# EAGLE design TA#2_DONG (EAGLE 6.2)
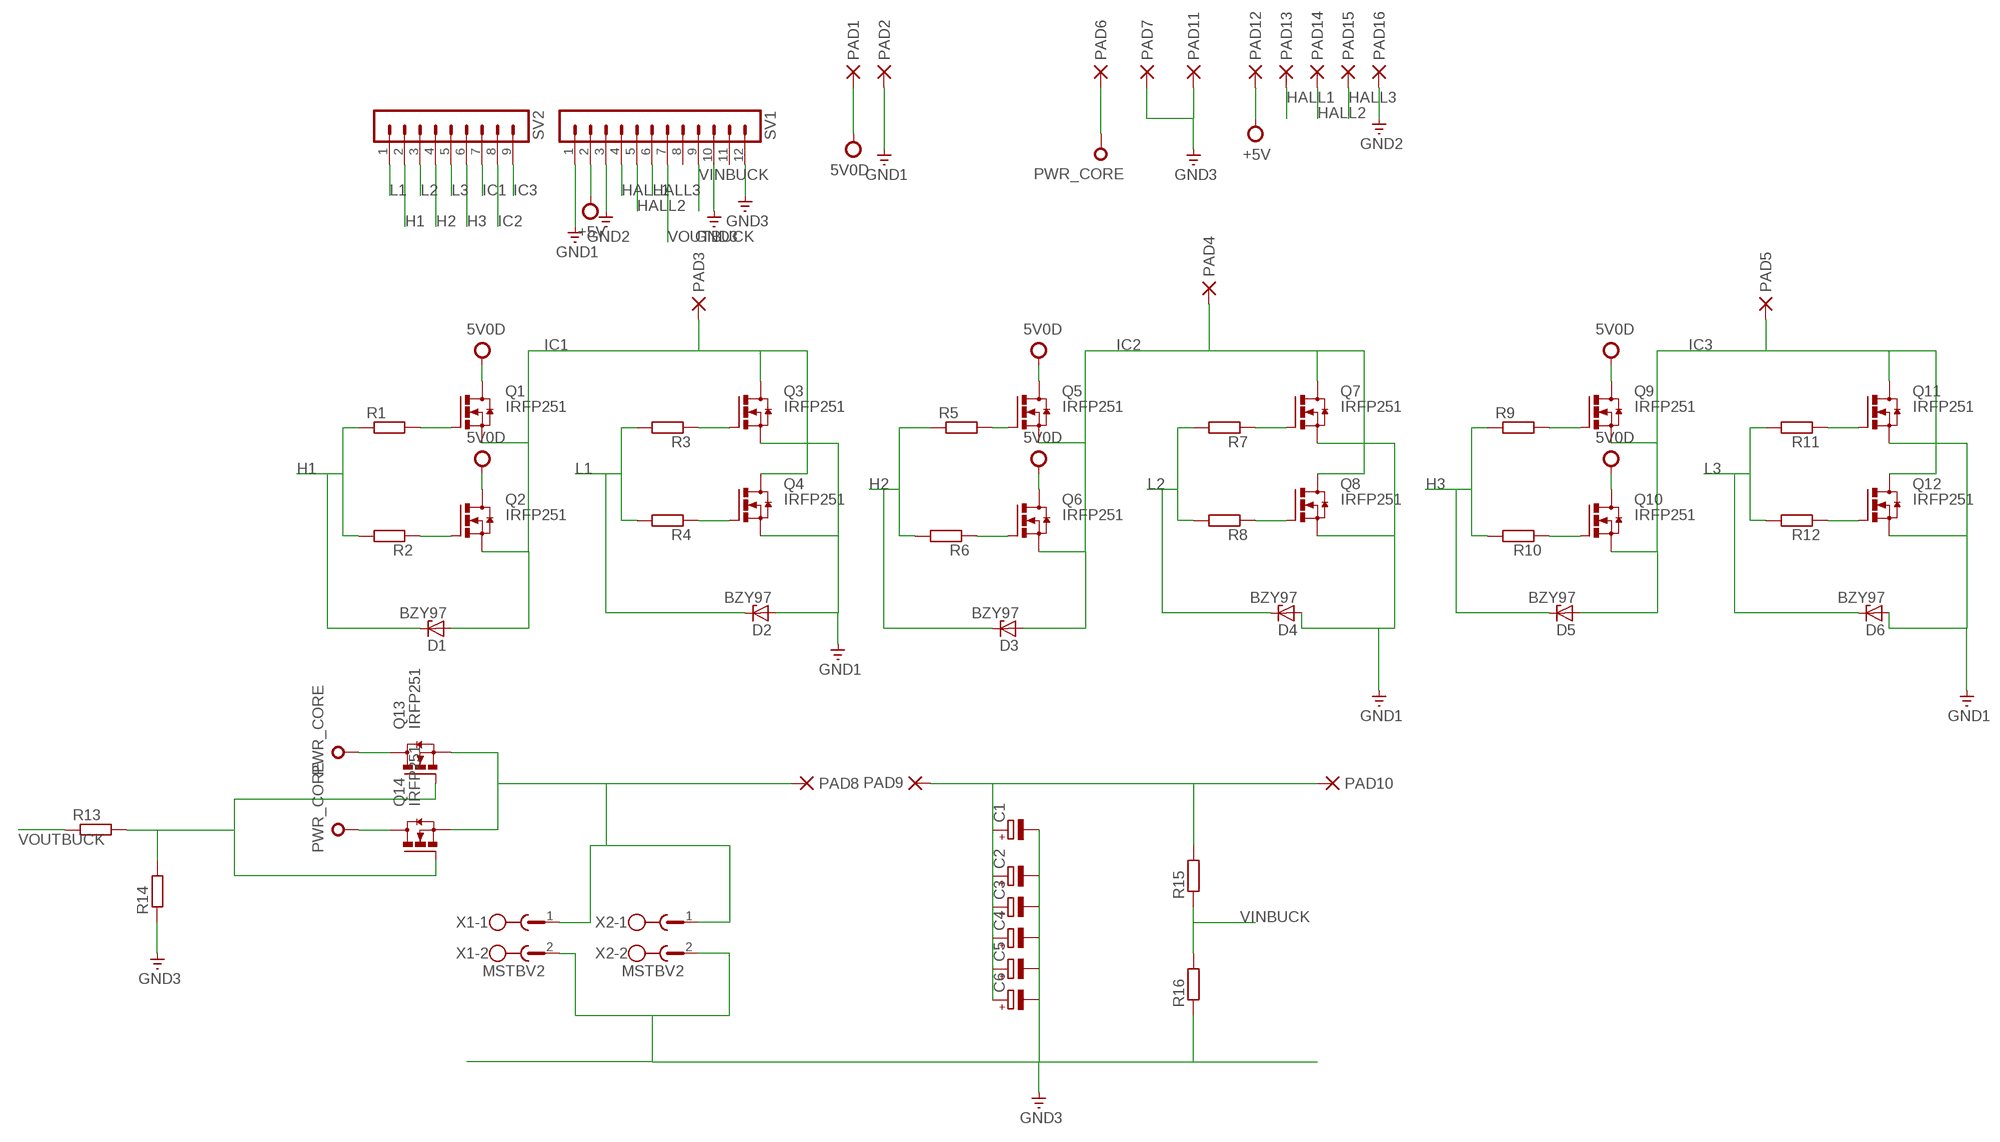
[diagram p0: schematic, sheet 1]

## Parts
C1  CPOL-EUTT5D9  [TT5D9]
C2  CPOL-EUTT5D9  [TT5D9]
C3  CPOL-EUTT5D9  [TT5D9]
C4  CPOL-EUTT5D9  [TT5D9]
C5  CPOL-EUTT5D9  [TT5D9]
C6  CPOL-EUTT5D9  [TT5D9]
D1  BZY97  [F126Z12]
D2  BZY97  [F126Z12]
D3  BZY97  [F126Z12]
D4  BZY97  [F126Z12]
D5  BZY97  [F126Z12]
D6  BZY97  [F126Z12]
PAD1  PAD-0820  [0820]
PAD2  PAD-0820  [0820]
PAD3  PAD-0820  [0820]
PAD4  PAD-0820  [0820]
PAD5  PAD-0820  [0820]
PAD6  PAD-0820  [0820]
PAD7  PAD-0820  [0820]
PAD8  PAD-0820  [0820]
PAD9  PAD-0820  [0820]
PAD10  PAD-0820  [0820]
PAD11  PAD-0820  [0820]
PAD12  PAD-0820  [0820]
PAD13  PAD-0820  [0820]
PAD14  PAD-0820  [0820]
PAD15  PAD-0820  [0820]
PAD16  PAD-0820  [0820]
Q1  IRFP251  [TO-247AD-V]
Q2  IRFP251  [TO-247AD-V]
Q3  IRFP251  [TO-247AD-V]
Q4  IRFP251  [TO-247AD-V]
Q5  IRFP251  [TO-247AD-V]
Q6  IRFP251  [TO-247AD-V]
Q7  IRFP251  [TO-247AD-V]
Q8  IRFP251  [TO-247AD-V]
Q9  IRFP251  [TO-247AD-V]
Q10  IRFP251  [TO-247AD-V]
Q11  IRFP251  [TO-247AD-V]
Q12  IRFP251  [TO-247AD-V]
Q13  IRFP251  [TO-247AD-V]
Q14  IRFP251  [TO-247AD-V]
R1  R-EU_0207/15  [0207/15]
R2  R-EU_0207/15  [0207/15]
R3  R-EU_0207/15  [0207/15]
R4  R-EU_0207/15  [0207/15]
R5  R-EU_0207/15  [0207/15]
R6  R-EU_0207/15  [0207/15]
R7  R-EU_0207/15  [0207/15]
R8  R-EU_0207/15  [0207/15]
R9  R-EU_0207/15  [0207/15]
R10  R-EU_0207/15  [0207/15]
R11  R-EU_0207/15  [0207/15]
R12  R-EU_0207/15  [0207/15]
R13  R-EU_0207/15  [0207/15]
R14  R-EU_0207/15  [0207/15]
R15  R-EU_0207/15  [0207/15]
R16  R-EU_0207/15  [0207/15]
SV1  MA12-1  [MA12-1]
SV2  MA09-1  [MA09-1]
X1  MSTBV2  [MSTBV2]
X2  MSTBV2  [MSTBV2]

## Nets
5V0D: PAD1.P$1(P) Q1.D Q2.D Q5.D Q6.D Q9.D Q10.D
+5V: PAD12.P$1(P) SV1.2
GND1: D2.A D4.A D6.A PAD2.P$1(P) Q3.S Q4.S Q7.S Q8.S Q11.S Q12.S SV1.1
GND2: PAD16.P$1(P) SV1.3
GND3: C1.- C2.- C3.- C4.- C5.- C6.- PAD7.P$1(P) PAD11.P$1(P) R14.1 R16.1 SV1.10 SV1.12 X1.2 X2.2
H1: D1.C R1.1 R2.2 SV2.2
H2: D3.C R5.1 R6.2 SV2.4
H3: D5.C R9.1 R10.2 SV2.6
HALL1: PAD13.P$1(P) SV1.4
HALL2: PAD14.P$1(P) SV1.5
HALL3: PAD15.P$1(P) SV1.6
IC1: D1.A PAD3.P$1(P) Q1.S Q2.S Q3.D Q4.D SV2.7
IC2: D3.A PAD4.P$1(P) Q5.S Q6.S Q7.D Q8.D SV2.8
IC3: D5.A PAD5.P$1(P) Q9.S Q10.S Q11.D Q12.D SV2.9
L1: D2.C R3.2 R4.2 SV2.1
L2: D4.C R7.2 R8.2 SV2.3
L3: D6.C R11.2 R12.2 SV2.5
N$1: Q1.G R1.2
N$2: Q2.G R2.1
N$3: Q3.G R3.1
N$4: Q4.G R4.1
N$5: PAD8.P$1(P) Q13.S Q14.S X1.1 X2.1
N$6: Q13.G Q14.G R13.2 R14.2
N$7: Q5.G R5.2
N$9: C1.+ C2.+ C3.+ C4.+ C5.+ C6.+ PAD9.P$1(P) PAD10.P$1(P) R15.2
N$10: Q6.G R6.1
N$11: Q7.G R7.1
N$12: Q8.G R8.1
N$17: Q9.G R9.2
N$18: Q10.G R10.1
N$19: Q11.G R11.1
N$20: Q12.G R12.1
PWR_CORE: PAD6.P$1(P) Q13.D Q14.D
VINBUCK: R15.1 R16.2 SV1.9
VOUTBUCK: R13.1 SV1.7
Unconnected: SV1.8 SV1.11

## Library data of the parts
C1-C6 = rcl:CPOL-EU: POLARIZED CAPACITOR, European symbol
D1-D6 = diode-1:BZY97: Z DIODE
PAD1-PAD16 = dpads:PAD: WIRE PAD Standard US Drill Sizes and SMD pads
Q1-Q14 = transistor-power:IRFP25*: 33A/27A, 200V/150V, 0.085/0.012 Ohm, N-Channel Power MOSFET Source: Fairchild Semiconductor Corporation
R1-R16 = resistor:R-EU_: RESISTOR, European symbol
SV1 = con-lstb:MA12-1: PIN HEADER; OC_FARNELL: unknown; OC_NEWARK: unknown
SV2 = con-lstb:MA09-1: PIN HEADER; OC_FARNELL: unknown; OC_NEWARK: unknown
X1 X2 = con-phoenix-508:MSTBV2: PHOENIX; MPN: MSTBV 2,5/2-GF-5.08; OC_FARNELL: 1792792; OC_NEWARK: 69R9845

## Board
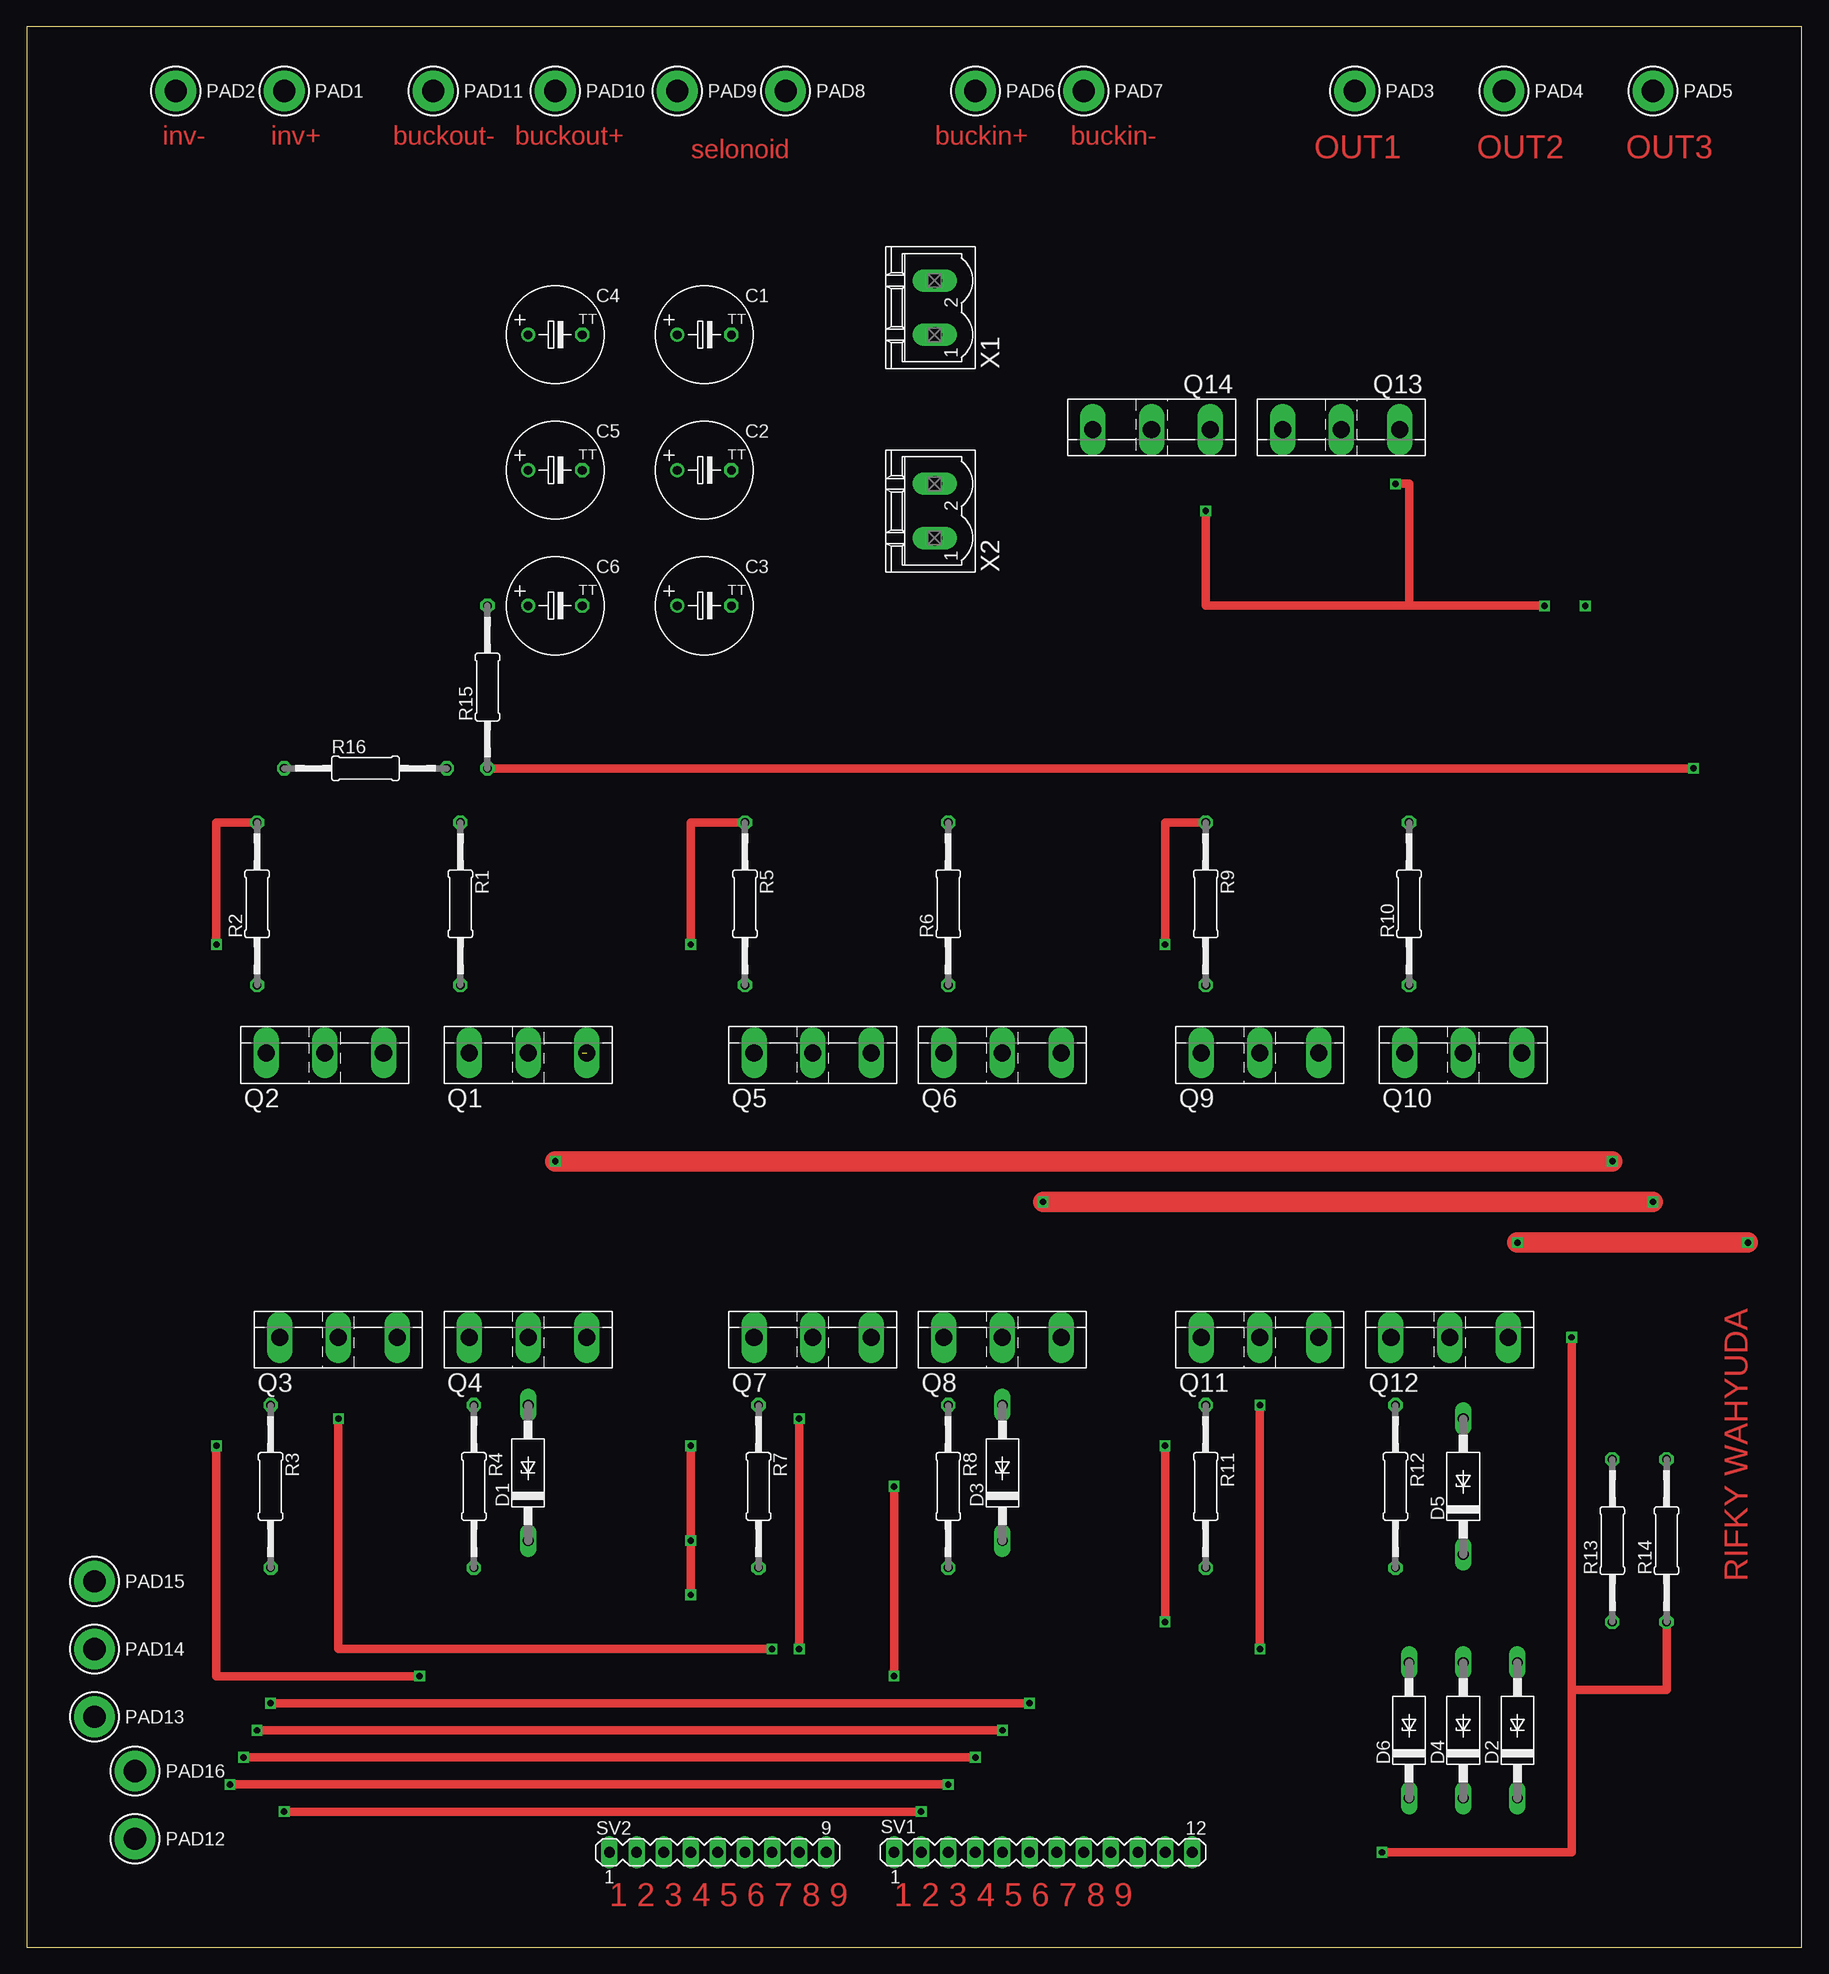
[diagram p1: board, top side]
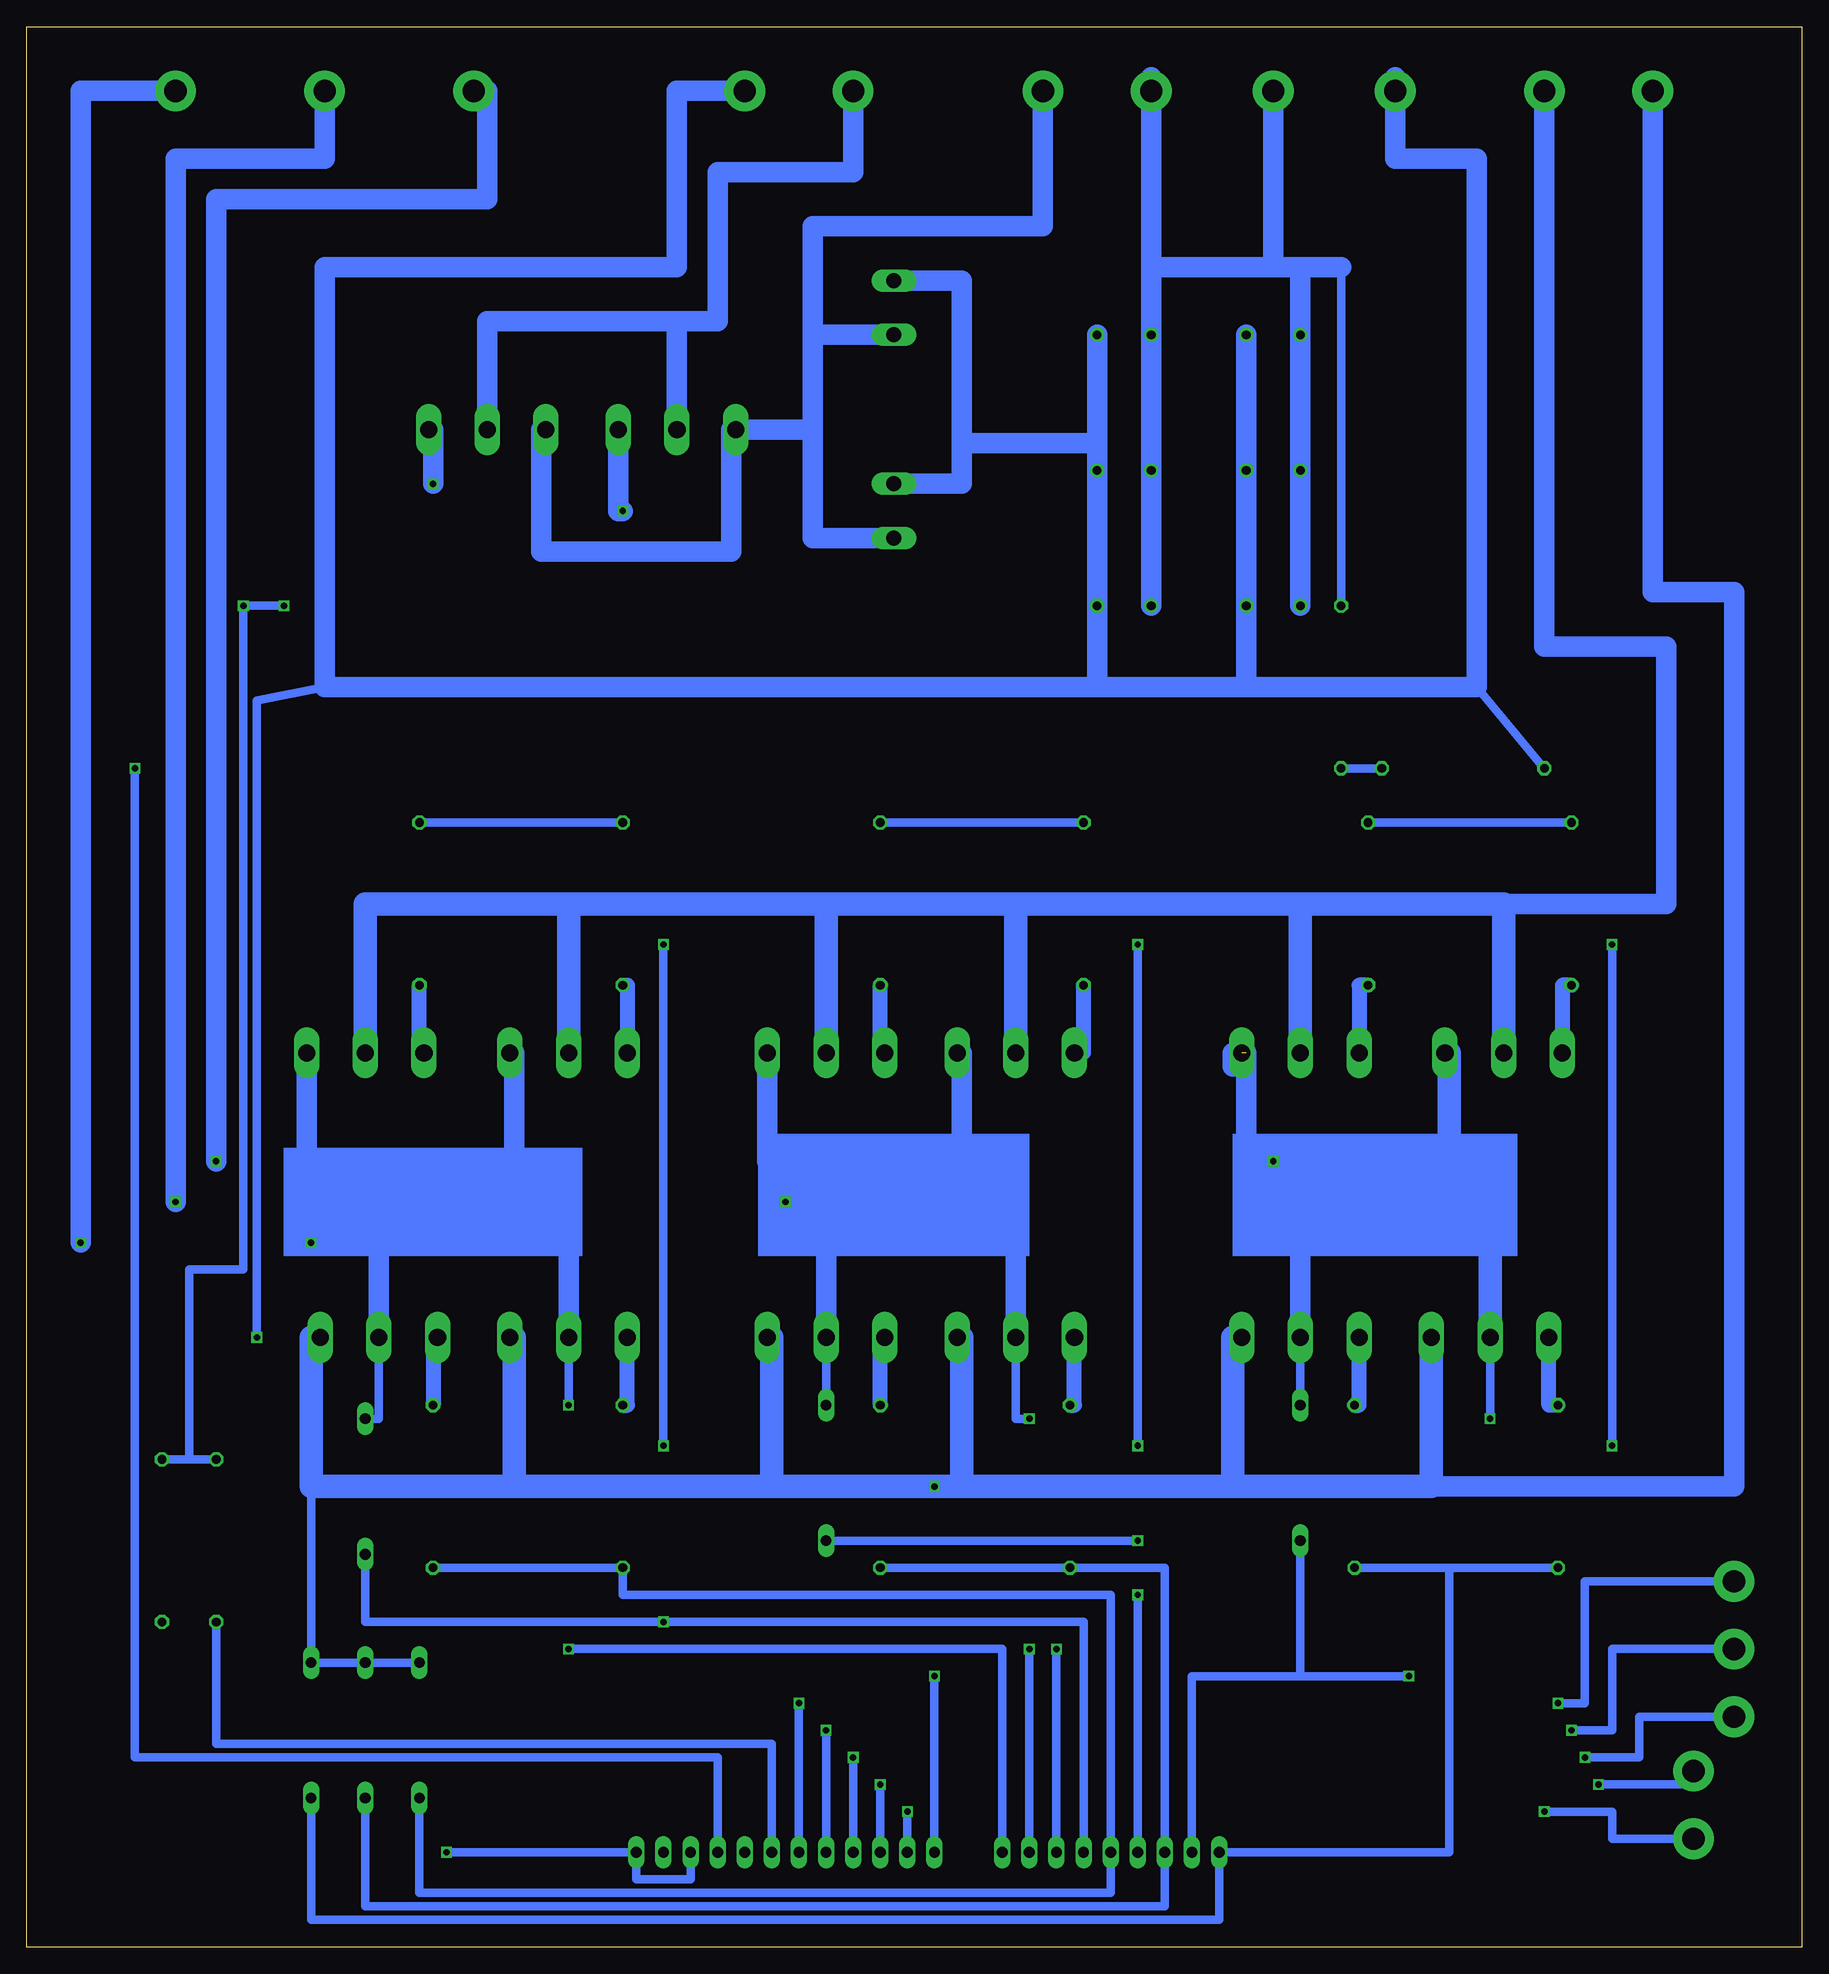
[diagram p2: board, bottom side, seen from below]

Size 166.35 x 180.01 mm. Coordinates in mm from the lower left corner, seen from the top.
Outline: 0,0 166.35,0 166.35,180.01 0,180.01 0,0
Copper layers (1*16): Top 0.035mm / dielectric 1.5mm / Bottom 0.035mm
Design rules: minimum track width 10mil, minimum drill 24mil, track to track 8mil, track to pad 8mil, pad to pad 8mil, via to via 8mil, smd to smd 8mil, copper to edge 40mil, drill to drill 8mil, minimum pad ring 10mil, minimum via ring 8mil, stop-mask expansion 4mil, vias tented up to drill 0mil, thermal gap 10mil

### Footprints (pad centres in the part's own frame; a part is rotated, then mirrored left to right if it is on the bottom)
TT5D9 = drill 0.813: + -2.54,0 | drill 0.813 octagon: - 2.54,0
F126Z12 = drill 1.016 long: A 6.35,0; C -6.35,0
0820 = drill 2.083 pad 3.81: P$1 0,0
TO-247AD-V = drill 1.6 long: D 0,-2.54; G -5.5,-2.54; S 5.5,-2.54
0207/15 = drill 0.813 octagon: 1 -7.62,0; 2 7.62,0
MA12-1 = drill 1.016 long: 1 -13.97,0; 2 -11.43,0; 3 -8.89,0; 4 -6.35,0; 5 -3.81,0; 6 -1.27,0; 7 1.27,0; 8 3.81,0; 9 6.35,0; 10 8.89,0; 11 11.43,0; 12 13.97,0
MA09-1 = drill 1.016 long: 1 -10.16,0; 2 -7.62,0; 3 -5.08,0; 4 -2.54,0; 5 0,0; 6 2.54,0; 7 5.08,0; 8 7.62,0; 9 10.16,0
MSTBV2 = drill 1.397 long: 1 -2.54,0; 2 2.54,0

### Placement (x,y rotation side)
C1  63.5,151.13 0 top
C2  63.5,138.43 0 top
C3  63.5,125.73 0 top
C4  49.53,151.13 0 top
C5  49.53,138.43 0 top
C6  49.53,125.73 0 top
D1  46.99,44.45 90 top
D2  139.7,20.32 90 top
D3  91.44,44.45 90 top
D4  134.62,20.32 90 top
D5  134.62,43.18 90 top
D6  129.54,20.32 90 top
PAD1  24.13,173.99 0 top
PAD2  13.97,173.99 0 top
PAD3  124.46,173.99 0 top
PAD4  138.43,173.99 0 top
PAD5  152.4,173.99 0 top
PAD6  88.9,173.99 0 top
PAD7  99.06,173.99 0 top
PAD8  71.12,173.99 0 top
PAD9  60.96,173.99 0 top
PAD10  49.53,173.99 0 top
PAD11  38.1,173.99 0 top
PAD12  10.16,10.16 0 top
PAD13  6.35,21.59 0 top
PAD14  6.35,27.94 0 top
PAD15  6.35,34.29 0 top
PAD16  10.16,16.51 0 top
Q1  46.99,86.36 0 top
Q2  27.94,86.36 0 top
Q3  29.21,59.69 0 top
Q4  46.99,59.69 0 top
Q5  73.66,86.36 0 top
Q6  91.44,86.36 0 top
Q7  73.66,59.69 0 top
Q8  91.44,59.69 0 top
Q9  115.57,86.36 0 top
Q10  134.62,86.36 0 top
Q11  115.57,59.69 0 top
Q12  133.35,59.69 0 top
Q13  123.19,139.7 180 top
Q14  105.41,139.7 180 top
R1  40.64,97.79 270 top
R2  21.59,97.79 90 top
R3  22.86,43.18 270 top
R4  41.91,43.18 270 top
R5  67.31,97.79 270 top
R6  86.36,97.79 90 top
R7  68.58,43.18 270 top
R8  86.36,43.18 270 top
R9  110.49,97.79 270 top
R10  129.54,97.79 90 top
R11  110.49,43.18 270 top
R12  128.27,43.18 270 top
R13  148.59,38.1 90 top
R14  153.67,38.1 90 top
R15  43.18,118.11 90 top
R16  31.75,110.49 0 top
SV1  95.25,8.89 0 top
SV2  64.77,8.89 0 top
X1  85.09,153.67 90 top
X2  85.09,134.62 90 top

### Tracks (layer width: path | path; a pad name or v marks a point on that pad's centre or on a via)
5V0D
  Bottom 1.93: 27.94,97.79 12.7,97.79 12.7,121.92 24.13,121.92 PAD1.P$1
  Bottom 2.184: Q2.D 27.94,97.79 46.99,97.79 | 46.99,97.79 73.66,97.79 | 91.44,97.79 115.57,97.79 | 115.57,97.79 134.62,97.79 Q10.D | Q1.D 46.99,97.79 | Q9.D 115.57,97.79 | Q5.D 73.66,97.79 | 73.66,97.79 91.44,97.79 | 91.44,97.79 Q6.D
+5V  (via drill 0.6)
  Top 0.813: v83.82,12.7 v24.13,12.7
  Bottom 0.813: SV1.2 v83.82,12.7 | v24.13,12.7 17.78,12.7 17.78,10.16 PAD12.P$1
GND1  (via drill 0.6)
  Top 0.813: v81.28,25.4 v81.28,43.18
  Bottom 0.813: 139.7,43.18 D2.A D4.A D6.A | SV1.1 v81.28,25.4 | v81.28,43.18 76.2,43.18
  Bottom 1.93: 34.71,43.18 6.35,43.18 6.35,127 13.97,127 PAD2.P$1
  Bottom 2.184: Q3.S 34.71,43.18 53.34,43.18 | Q4.S 53.34,57.15 53.34,43.18 | Q11.S 120.65,57.15 120.65,43.18 | 120.65,43.18 96.52,43.18 | 96.52,43.18 v81.28,43.18 78.74,43.18 | 78.74,43.18 76.2,43.18 53.34,43.18 | Q7.S 78.74,57.15 78.74,43.18 | Q8.S 96.52,57.15 96.52,43.18 | Q12.S 139.7,57.15 139.7,43.18 120.65,43.18
GND2  (via drill 0.6)
  Top 0.813: v86.36,15.24 v19.05,15.24
  Bottom 0.813: SV1.3 v86.36,15.24 | PAD16.P$1 10.16,15.24 v19.05,15.24
GND3  (via drill 0.6)
  Top 0.813: v127,8.89 144.78,8.89 144.78,24.13 | 144.78,24.13 v144.78,57.15 | R14.1 153.67,24.13 144.78,24.13
  Bottom 0.813: R16.1 30.48,118.11 | v127,8.89 SV1.12 109.22,6.35 104.14,6.35 SV1.10 | v144.78,57.15 144.78,116.84 138.43,118.11
  Bottom 1.93: 66.04,118.11 138.43,118.11 138.43,157.48 105.41,157.48 105.41,173.99 PAD7.P$1 | X2.2 78.74,137.16 78.74,140.97 | 78.74,140.97 78.74,156.21 X1.2 | C1.- 66.04,140.97 | 66.04,140.97 C2.- C3.- 66.04,118.11 | C4.- C5.- C6.- 52.07,118.11 | 52.07,118.11 30.48,118.11 30.48,167.64 38.1,167.64 PAD11.P$1 38.1,175.26 | 52.07,118.11 66.04,118.11 | 78.74,140.97 66.04,140.97
H1  (via drill 0.6)
  Top 0.813: v36.83,25.4 17.78,25.4 v17.78,46.99 | R2.2 17.78,105.41 v17.78,93.98
  Bottom 0.813: R2.2 R1.1 | SV2.2 57.15,25.4 46.99,25.4 | 46.99,25.4 v36.83,25.4 | D1.C 46.99,25.4 | v17.78,46.99 v17.78,93.98
H2  (via drill 0.6)
  Top 0.813: v62.23,33.02 v62.23,38.1 v62.23,46.99 | R5.1 62.23,105.41 v62.23,93.98
  Bottom 0.813: R5.1 R6.2 | SV2.4 v62.23,33.02 | D3.C v62.23,38.1 | v62.23,46.99 v62.23,93.98
H3  (via drill 0.6)
  Top 0.813: R9.1 106.68,105.41 v106.68,93.98 | v106.68,30.48 v106.68,46.99
  Bottom 0.813: R9.1 R10.2 | SV2.6 67.31,30.48 v106.68,30.48 134.62,30.48 D5.C | v106.68,46.99 v106.68,93.98
HALL1  (via drill 0.6)
  Top 0.813: v88.9,17.78 v20.32,17.78
  Bottom 0.813: SV1.4 v88.9,17.78 | v20.32,17.78 15.24,17.78 15.24,21.59 PAD13.P$1
HALL2  (via drill 0.6)
  Top 0.813: v91.44,20.32 v21.59,20.32
  Bottom 0.813: SV1.5 v91.44,20.32 | v21.59,20.32 17.78,20.32 17.78,27.94 PAD14.P$1
HALL3  (via drill 0.6)
  Top 0.813: v93.98,22.86 v22.86,22.86
  Bottom 0.813: SV1.6 v93.98,22.86 | v22.86,22.86 20.32,22.86 20.32,34.29 PAD15.P$1
IC1  (via drill 0.6)  (1 unrouted)
  Top 0.813: v69.85,27.94 29.21,27.94 v29.21,49.53
  Top 1.93: v148.59,73.66 v49.53,73.66
  Bottom 0.813: D1.A Q4.D | SV2.7 v69.85,27.94 | v29.21,49.53 Q3.D
  Bottom 1.93: Q4.D 46.99,74.93 52.07,74.93 52.07,82.55 | 52.07,82.55 53.34,82.55 53.34,83.82 52.07,83.82 52.07,82.55 | PAD3.P$1 123.19,173.99 123.19,163.83 148.59,163.83 v148.59,73.66 | v49.53,73.66 44.45,73.66 44.45,74.93
  Bottom 2.184: Q2.S 33.02,83.82 33.02,74.93 | 33.02,74.93 44.45,74.93 46.99,74.93 | Q3.D 29.21,67.31 33.02,67.31 33.02,74.93
IC2  (via drill 0.6)
  Top 0.813: v72.39,27.94 v72.39,49.53
  Top 1.93: v152.4,69.85 v95.25,69.85
  Bottom 0.813: D3.A Q8.D | SV2.8 v72.39,27.94 | v72.39,49.53 73.66,49.53 Q7.D
  Bottom 1.93: Q5.S 78.74,83.82 78.74,74.93 91.44,74.93 | 91.44,74.93 96.52,74.93 96.52,73.66 96.94,73.66 Q6.S | 91.44,71.12 91.44,74.93 | Q8.D 91.44,68.58 91.44,69.85 | 91.44,69.85 91.44,71.12 | 91.44,71.12 73.66,71.12 Q7.D | PAD4.P$1 138.43,167.64 152.4,167.64 v152.4,69.85 | v95.25,69.85 91.44,69.85
IC3  (via drill 0.6)
  Top 0.813: v115.57,27.94 v115.57,50.8
  Top 1.93: v161.29,66.04 v139.7,66.04
  Bottom 0.813: D5.A 133.35,49.53 133.35,58.42 | SV2.9 74.93,27.94 v115.57,27.94 | v115.57,50.8 Q11.D
  Bottom 1.93: Q9.S 120.65,83.82 120.65,73.66 | 120.65,73.66 133.35,73.66 | 133.35,73.66 140.12,73.66 | 140.97,73.66 140.12,73.66 | 140.12,73.66 Q10.S | Q11.D 115.57,72.39 120.65,72.39 120.65,73.66 | Q12.D 133.35,58.42 133.35,66.04 | 133.35,66.04 133.35,73.66 | PAD5.P$1 161.29,173.99 v161.29,66.04 | v139.7,66.04 133.35,66.04
L1
  Bottom 0.813: R3.2 33.02,35.56 | 33.02,35.56 R4.2 | 33.02,35.56 33.02,8.89 SV2.1 54.61,2.54 139.7,2.54 D2.C
L2
  Bottom 0.813: R8.2 R7.2 59.69,35.56 SV2.3 59.69,3.81 134.62,3.81 D4.C
L3
  Bottom 0.813: R12.2 R11.2 110.49,33.02 64.77,33.02 SV2.5 64.77,5.08 129.54,5.08 D6.C
N$1
  Bottom 1.422: R1.2 41.49,90.17 Q1.G
N$2
  Bottom 1.422: R2.1 22.44,90.17 Q2.G
N$3
  Bottom 1.422: R3.1 23.71,50.8 Q3.G
N$4
  Bottom 1.422: R4.1 41.49,50.8 Q4.G
N$5
  Bottom 1.93: X1.1 92.71,151.13 | 92.71,151.13 92.71,142.24 | 92.71,142.24 92.71,132.08 X2.1 | 92.71,142.24 Q14.S 100.33,142.24 100.33,130.81 118.11,130.81 118.11,142.24 Q13.S | 92.71,151.13 92.71,161.29 71.12,161.29 PAD8.P$1
N$6  (via drill 0.6)
  Top 0.813: 129.54,125.73 110.49,125.73 v110.49,134.62 | v128.27,137.16 129.54,137.16 129.54,125.73 | v142.24,125.73 129.54,125.73
  Bottom 0.813: R14.2 R13.2 151.13,45.72 151.13,63.5 146.05,63.5 v146.05,125.73 v142.24,125.73
  Bottom 1.93: v110.49,134.62 110.91,134.62 Q14.G | Q13.G 128.27,142.24 v128.27,137.16
N$7
  Bottom 1.422: Q5.G 67.31,83.82 R5.2
N$9
  Bottom 0.813: R15.2 43.18,157.48
  Bottom 1.93: C3.+ C2.+ C1.+ 60.96,157.48 | C6.+ C5.+ C4.+ 46.99,157.48 | 43.18,157.48 46.99,157.48 | 60.96,157.48 49.53,157.48 | 49.53,157.48 46.99,157.48 | 60.96,157.48 PAD9.P$1 60.96,175.26 | PAD10.P$1 49.53,157.48
N$10
  Bottom 1.422: Q6.G 86.36,83.82 R6.1
N$11
  Bottom 1.422: R7.1 68.16,50.8 Q7.G
N$12
  Bottom 1.422: R8.1 86.36,57.15 Q8.G
N$17
  Bottom 1.422: R9.2 110.07,90.17 Q9.G
N$18
  Bottom 1.422: Q10.G 129.54,83.82 R10.1
N$19
  Bottom 1.422: R11.1 110.07,50.8 Q11.G
N$20
  Bottom 1.422: Q12.G 128.27,57.15 R12.1
PWR_CORE
  Bottom 1.93: 105.41,152.4 106.68,152.4 123.19,152.4 Q13.D | 105.41,152.4 Q14.D | PAD6.P$1 88.9,166.37 101.6,166.37 101.6,152.4 105.41,152.4
VINBUCK  (via drill 0.6)
  Top 0.813: v156.21,110.49 R15.1
  Bottom 0.813: R16.2 R15.1 | SV1.9 101.6,17.78 156.21,17.78 v156.21,110.49
VOUTBUCK
  Bottom 0.813: SV1.7 96.52,19.05 148.59,19.05 R13.1
(copper drawn outside any net)
  shapes: Bottom area x3

### Text on the board
Top: inv- | inv+ | buckout- | buckout+ | buckin+ | buckin- | selonoid | OUT1 | OUT2 | OUT3 | RIFKY WAHYUDA | 1 2 3 4 5 6 7 8 9 | 1 2 3 4 5 6 7 8 9